# Altium schematic sheet ICSP.SchDoc
size A4; SheetNumber: 5; SheetTotal: 8
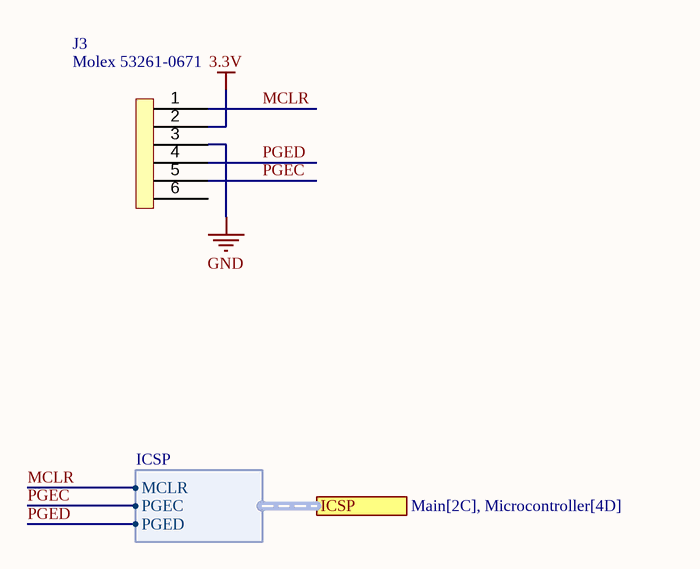
[diagram p0: ICSP.SchDoc]

## Parts
J3  Molex 53261-0671  [Molex 53261-0671]

## Ports
ICSP (harness ICSP, see Main[2C], Microcontroller[4D])

## Harnesses
ICSP: MCLR, PGEC, PGED

## Nets
3.3V: J3.2
GND: J3.3
MCLR: J3.1 ; port ICSP.MCLR
PGEC: J3.5 ; port ICSP.PGEC
PGED: J3.4 ; port ICSP.PGED

Not connected (* = marked no-connect by the designer): J3 6

## Notes on the sheet
- TITLE
- SIZE
- A4
- VARIANT
- PROJECT
- SHEET
- VERSION
- OF
- AUTHOR
- DATE